# Altium project 20bit_40MS_ADC_DIOT.PrjPcb (part 5 of 5)
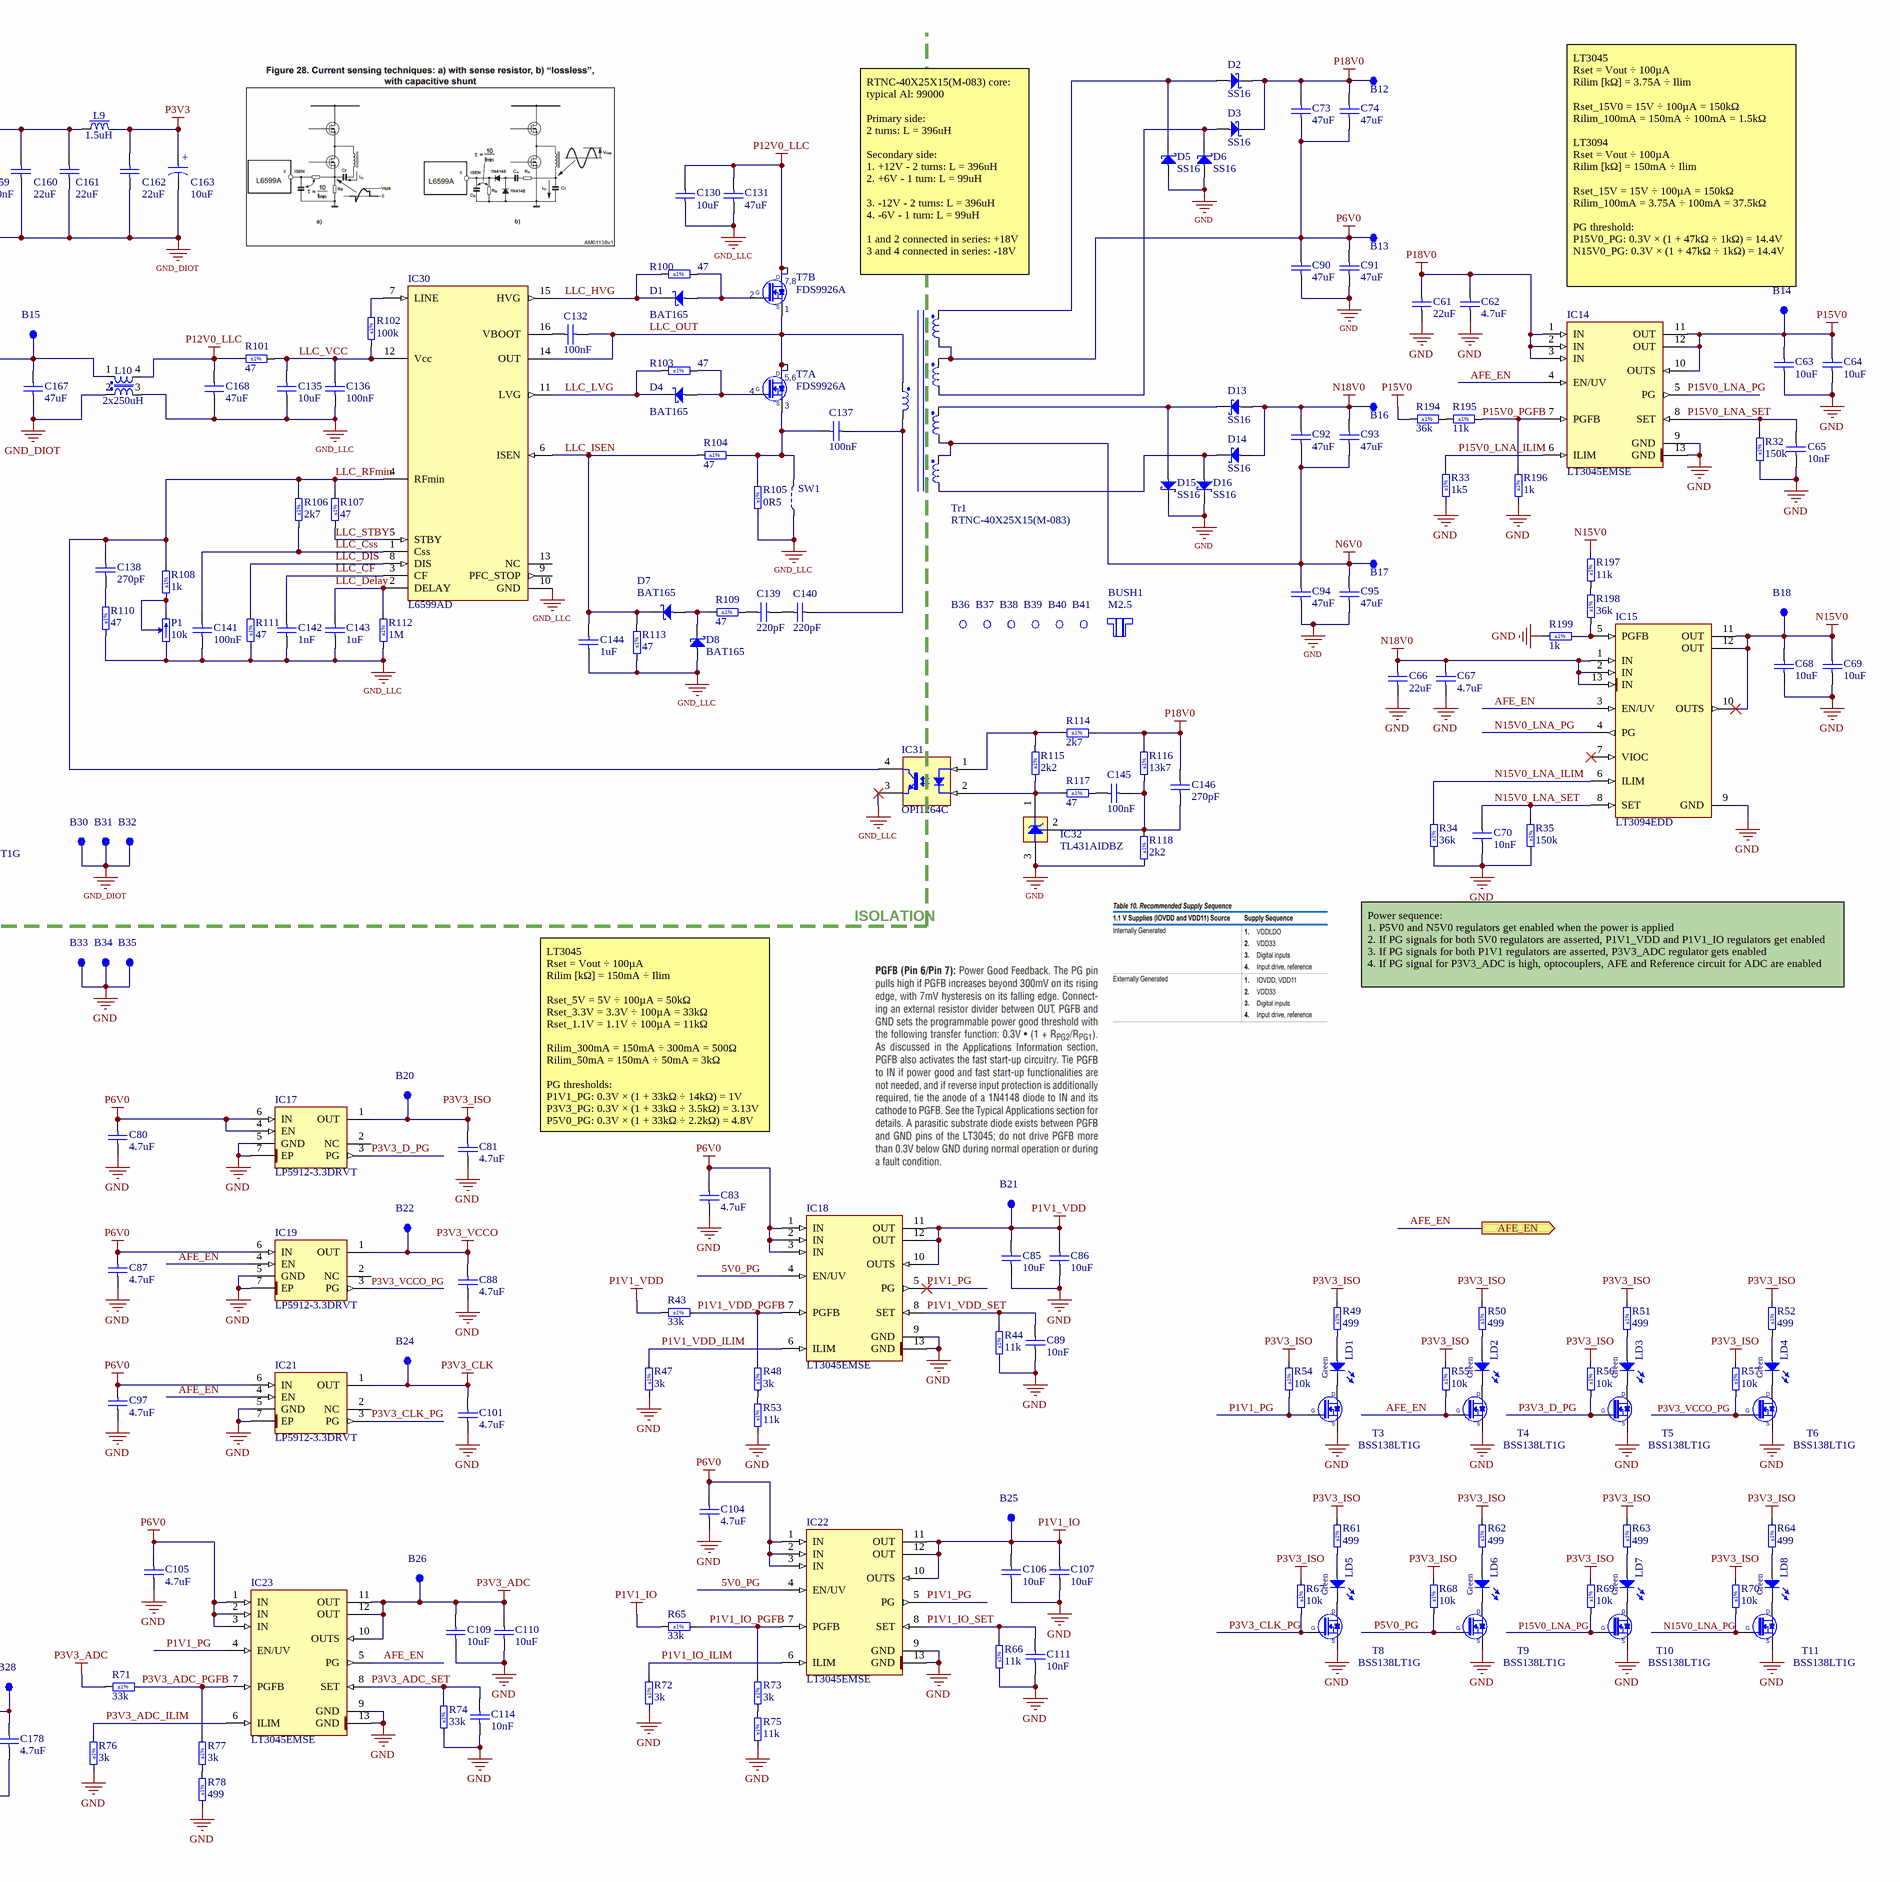
[diagram p11: Isolated_Power_supply.SchDoc, right]

## Nets that join several sheets
GND: ADC_40M20b (C2.2 R31.2 R36.2), CPCIS_Connectors_P1_P6 (66 pins), U_AFE (21 pins), U_LNA (12 pins), U_ADC (18 pins), PLL (44 pins), U_ADC (18 pins), U_AFE (21 pins), U_LNA (12 pins), Data_Interface (13 pins), Optocouplers (82 pins), EEM_Connectors (36 pins), Isolated_Power_supply (155 pins)
N5V0: U_AFE (16 pins), U_AFE (16 pins), Isolated_Power_supply (5 pins)
N15V0: U_LNA (C184B.1 J1B.13), U_LNA (C184A.1 J1A.13), Isolated_Power_supply (7 pins)
P1V1_IO: U_ADC (IC1B.A6), U_ADC (IC1A.A6), Isolated_Power_supply (7 pins)
P1V1_VDD: U_ADC (IC1B.A1 IC1B.A2 IC1B.A3), U_ADC (IC1A.A1 IC1A.A2 IC1A.A3), Isolated_Power_supply (7 pins)
P2V5_VREF: PLL (C155.2 IC35.2), Isolated_Power_supply (5 pins)
P3V0_REF: U_AFE (IC4B.8), U_ADC (C5B.2 IC1B.F4 IC1B.G4), U_ADC (C5A.2 IC1A.F4 IC1A.G4), U_AFE (IC4A.8), Isolated_Power_supply (8 pins)
P3V3: Data_Interface (8 pins), Optocouplers (21 pins), EEM_Connectors (C298.2 IC40.14), Isolated_Power_supply (5 pins)
P3V3_ADC: U_ADC (IC1B.F3 IC1B.G3), U_ADC (IC1A.F3 IC1A.G3), Isolated_Power_supply (7 pins)
P3V3_CLK: PLL (16 pins), Isolated_Power_supply (5 pins)
P3V3_DAC: PLL (6 pins), Isolated_Power_supply (C175.1 C177.2 L11.1 R142.2)
P3V3_DIOT: CPCIS_Connectors_P1_P6 (13 pins), Isolated_Power_supply (C174.1 D22.2 IC38.5)
P3V3_ISO: U_LNA (J1B.1), U_LNA (J1A.1), Data_Interface (C58.2 IC10.6 IC10.16), Optocouplers (17 pins), Isolated_Power_supply (19 pins)
P3V3_MP: EEM_Connectors (5 pins), Isolated_Power_supply (5 pins)
P3V3_VCCO: PLL (8 pins), Isolated_Power_supply (B22.1 C88.2 IC19.1)
P5V0: U_AFE (14 pins), U_AFE (14 pins), Isolated_Power_supply (B19.1 C76.1 C79.2 L7.2)
P12V0_DIOT: CPCIS_Connectors_P1_P6 (7 pins), EEM_Connectors (R257.1 R260.1 R261.1 R262.1), Isolated_Power_supply (C173.2 IC38.1 IC38.3)
P12V0_EEM: EEM_Connectors (8 pins), Isolated_Power_supply (13 pins)
P15V0: U_LNA (C183B.1 J1B.14), U_LNA (C183A.1 J1A.14), Isolated_Power_supply (7 pins)
AD9508_OUT0_N: U_ADC (IC1B.A5 R5B.2), PLL (IC8.3)
AD9508_OUT0_P: U_ADC (IC1B.A4 R5B.1), PLL (IC8.2)
AD9508_OUT1_N: U_ADC (IC1B.B7 R6B.1), PLL (IC8.8)
AD9508_OUT1_P: U_ADC (IC1B.A7 R6B.2), PLL (IC8.7)
AD9508_OUT2_N: PLL (IC8.12), U_ADC (IC1A.A5 R5A.2)
AD9508_OUT2_P: PLL (IC8.11), U_ADC (IC1A.A4 R5A.1)
AD9508_OUT3_N: PLL (IC8.17), U_ADC (IC1A.B7 R6A.1)
AD9508_OUT3_P: PLL (IC8.16), U_ADC (IC1A.A7 R6A.2)
ADC_CSn: U_ADC (B3B.1 IC1B.G1), Data_Interface (IC10.10)
ADC_CSn: U_ADC (B3A.1 IC1A.G1), Data_Interface (IC10.13)
ADC_DA_N: U_ADC (IC1B.D7), Optocouplers (MOD1.26)
ADC_DA_N: U_ADC (IC1A.D7), Optocouplers (MOD1.14)
ADC_DA_P: U_ADC (IC1B.C7), Optocouplers (MOD1.27)
ADC_DA_P: U_ADC (IC1A.C7), Optocouplers (MOD1.15)
ADC_DB_N: U_ADC (IC1B.D6), Optocouplers (MOD1.20)
ADC_DB_N: U_ADC (IC1A.D6), Optocouplers (MOD1.8)
ADC_DB_P: U_ADC (IC1B.C6), Optocouplers (MOD1.21)
ADC_DB_P: U_ADC (IC1A.C6), Optocouplers (MOD1.9)
ADC_SCLK: U_LNA (J1B.4), U_ADC (IC1B.E7), PLL (B6.1 IC7.1 IC8.19 IC35.7), U_ADC (IC1A.E7), U_LNA (J1A.4), Optocouplers (IC28.8)
ADC_SDI: U_LNA (J1B.6), U_ADC (IC1B.F7), PLL (B7.1 IC7.2 IC8.24 IC35.6), U_ADC (IC1A.F7), U_LNA (J1A.6), Optocouplers (IC33.8)
ADCIN_N: U_AFE (R16B.2), U_ADC (R3B.1 R4B.1)
ADCIN_N: U_ADC (R3A.1 R4A.1), U_AFE (R16A.2)
ADCIN_P: U_AFE (R8B.2), U_ADC (R1B.1 R2B.1)
ADCIN_P: U_ADC (R1A.1 R2A.1), U_AFE (R8A.2)
AFE_EN: U_AFE (5 pins), U_LNA (J1B.10), U_AFE (5 pins), U_LNA (J1A.10), Isolated_Power_supply (9 pins)
AFE_IN_N: U_AFE (IC6B.3), U_LNA (J1B.17)
AFE_IN_N: U_AFE (IC6A.3), U_LNA (J1A.17)
AFE_IN_P: U_AFE (IC2B.3), U_LNA (J1B.19)
AFE_IN_P: U_AFE (IC2A.3), U_LNA (J1A.19)
BP_I2C.SCL: CPCIS_Connectors_P1_P6 (D23.3 J6.B2), EEM_Connectors (R187.1)
BP_I2C.SDA: CPCIS_Connectors_P1_P6 (D23.1 J6.C2), EEM_Connectors (R186.1)
BP_IO.LVDS_N0: CPCIS_Connectors_P1_P6 (J6.E3), EEM_Connectors (R161.1)
BP_IO.LVDS_N1: CPCIS_Connectors_P1_P6 (J6.B3), EEM_Connectors (R162.1)
BP_IO.LVDS_N2: CPCIS_Connectors_P1_P6 (J6.C4), EEM_Connectors (R163.1)
BP_IO.LVDS_N3: CPCIS_Connectors_P1_P6 (J6.L4), EEM_Connectors (R164.1)
BP_IO.LVDS_N4: CPCIS_Connectors_P1_P6 (J6.I4), EEM_Connectors (R167.1)
BP_IO.LVDS_N5: CPCIS_Connectors_P1_P6 (J6.K5), EEM_Connectors (R168.1)
BP_IO.LVDS_N6: CPCIS_Connectors_P1_P6 (J6.H5), EEM_Connectors (R169.1)
BP_IO.LVDS_N7: CPCIS_Connectors_P1_P6 (J6.F6), EEM_Connectors (R170.1)
BP_IO.LVDS_N8: CPCIS_Connectors_P1_P6 (J6.C6), EEM_Connectors (R171.1)
BP_IO.LVDS_N9: CPCIS_Connectors_P1_P6 (J6.L6), EEM_Connectors (R172.1)
BP_IO.LVDS_N10: CPCIS_Connectors_P1_P6 (J6.I6), EEM_Connectors (R173.1)
BP_IO.LVDS_N11: CPCIS_Connectors_P1_P6 (J7.E1), EEM_Connectors (R174.1)
BP_IO.LVDS_N12: CPCIS_Connectors_P1_P6 (J7.B1), EEM_Connectors (R175.1)
BP_IO.LVDS_N13: CPCIS_Connectors_P1_P6 (J7.K1), EEM_Connectors (R176.1)
BP_IO.LVDS_N14: CPCIS_Connectors_P1_P6 (J7.H1), EEM_Connectors (R177.1)
BP_IO.LVDS_N15: CPCIS_Connectors_P1_P6 (J6.F2), EEM_Connectors (R144.2)
BP_IO.LVDS_P0: CPCIS_Connectors_P1_P6 (J6.D3), EEM_Connectors (R145.1)
BP_IO.LVDS_P1: CPCIS_Connectors_P1_P6 (J6.A3), EEM_Connectors (R146.1)
BP_IO.LVDS_P2: CPCIS_Connectors_P1_P6 (J6.B4), EEM_Connectors (R147.1)
BP_IO.LVDS_P3: CPCIS_Connectors_P1_P6 (J6.K4), EEM_Connectors (R148.1)
BP_IO.LVDS_P4: CPCIS_Connectors_P1_P6 (J6.H4), EEM_Connectors (R149.1)
BP_IO.LVDS_P5: CPCIS_Connectors_P1_P6 (J6.J5), EEM_Connectors (R150.1)
BP_IO.LVDS_P6: CPCIS_Connectors_P1_P6 (J6.G5), EEM_Connectors (R151.1)
BP_IO.LVDS_P7: CPCIS_Connectors_P1_P6 (J6.E6), EEM_Connectors (R152.1)
BP_IO.LVDS_P8: CPCIS_Connectors_P1_P6 (J6.B6), EEM_Connectors (R188.1)
BP_IO.LVDS_P9: CPCIS_Connectors_P1_P6 (J6.K6), EEM_Connectors (R189.1)
BP_IO.LVDS_P10: CPCIS_Connectors_P1_P6 (J6.H6), EEM_Connectors (R190.1)
BP_IO.LVDS_P11: CPCIS_Connectors_P1_P6 (J7.D1), EEM_Connectors (R156.1)
BP_IO.LVDS_P12: CPCIS_Connectors_P1_P6 (J7.A1), EEM_Connectors (R157.1)
BP_IO.LVDS_P13: CPCIS_Connectors_P1_P6 (J7.J1), EEM_Connectors (R158.1)
BP_IO.LVDS_P14: CPCIS_Connectors_P1_P6 (J7.G1), EEM_Connectors (R159.1)
BP_IO.LVDS_P15: CPCIS_Connectors_P1_P6 (J6.E2), EEM_Connectors (R143.2)
CSn_0: Data_Interface (IC10.1), Optocouplers (IC34.8)
CSn_1: Data_Interface (IC10.2), Optocouplers (IC27.8)
CSn_2: Data_Interface (IC10.3), Optocouplers (IC29.8)
CSn_AD4350: PLL (B9.1 IC7.3), Data_Interface (IC10.14)
CSn_AD9508: PLL (B10.1 IC8.1), Data_Interface (IC10.12)
CSn_DAC: PLL (B11.1 IC35.5), Data_Interface (IC10.15)
CSn_LNA_CH_A: U_LNA (B4B.1 J1B.8), Data_Interface (IC10.11)
CSn_LNA_CH_B: U_LNA (B4A.1 J1A.8), Data_Interface (IC10.9)
DIOT_ADC_A_DA_N: Optocouplers (MOD2.5), EEM_Connectors (J8.6 R162.2)
DIOT_ADC_A_DA_P: Optocouplers (MOD2.6), EEM_Connectors (J8.5 R146.2)
DIOT_ADC_A_DB_N: Optocouplers (MOD2.11), EEM_Connectors (J8.9 R163.2)
DIOT_ADC_A_DB_P: Optocouplers (MOD2.12), EEM_Connectors (J8.8 R147.2)
DIOT_ADC_B_DA_N: Optocouplers (MOD2.17), EEM_Connectors (J8.12 R164.2)
DIOT_ADC_B_DA_P: Optocouplers (MOD2.18), EEM_Connectors (J8.11 R148.2)
DIOT_ADC_B_DB_N: Optocouplers (MOD2.23), EEM_Connectors (J8.15 R167.2)
DIOT_ADC_B_DB_P: Optocouplers (MOD2.24), EEM_Connectors (J8.14 R149.2)
DIOT_CLK_DIOT_N: Optocouplers (MOD2.29), EEM_Connectors (J8.3 R161.2)
DIOT_CLK_DIOT_P: Optocouplers (MOD2.30), EEM_Connectors (J8.2 R145.2)
DIOT_CLK_N: PLL (C29.1), Optocouplers (MOD1.3)
DIOT_CLK_P: PLL (C28.1), Optocouplers (MOD1.2)
DIOT_CSn_0: Data_Interface (IC12.7), Optocouplers (R98.2)
DIOT_CSn_1: Data_Interface (IC12.6), Optocouplers (R82.2)
DIOT_CSn_2: Data_Interface (IC13.7), Optocouplers (R90.2)
DIOT_SPI_CLK: Data_Interface (IC11.7), Optocouplers (R89.2)
DIOT_SPI_MISO: Data_Interface (IC9.2), Optocouplers (IC26.8)
DIOT_SPI_MOSI: Data_Interface (IC11.6), Optocouplers (R97.2)
EEM0_I2C.SCL: EEM_Connectors (6 pins), Isolated_Power_supply (IC37.2)
EEM0_I2C.SDA: EEM_Connectors (6 pins), Isolated_Power_supply (IC37.1)
EEM_IO.LVDS_N8: Data_Interface (IC9.7), EEM_Connectors (J9.3 R171.2)
EEM_IO.LVDS_N9: Data_Interface (IC11.4 R26.1), EEM_Connectors (J9.6 R172.2)
EEM_IO.LVDS_N10: Data_Interface (IC11.1 R25.2), EEM_Connectors (J9.9 R173.2)
EEM_IO.LVDS_N11: Data_Interface (IC12.4 R28.1), EEM_Connectors (J9.12 R174.2)
EEM_IO.LVDS_N12: Data_Interface (IC12.1 R27.2), EEM_Connectors (J9.15 R175.2)
EEM_IO.LVDS_N13: Data_Interface (IC13.1 R29.2), EEM_Connectors (J9.18 R176.2)
EEM_IO.LVDS_P8: Data_Interface (IC9.8), EEM_Connectors (J9.2 R188.2)
EEM_IO.LVDS_P9: Data_Interface (IC11.3 R26.2), EEM_Connectors (J9.5 R189.2)
EEM_IO.LVDS_P10: Data_Interface (IC11.2 R25.1), EEM_Connectors (J9.8 R190.2)
EEM_IO.LVDS_P11: Data_Interface (IC12.3 R28.2), EEM_Connectors (J9.11 R156.2)
EEM_IO.LVDS_P12: Data_Interface (IC12.2 R27.1), EEM_Connectors (J9.14 R157.2)
EEM_IO.LVDS_P13: Data_Interface (IC13.2 R29.1), EEM_Connectors (J9.17 R158.2)
LNA_MISO: U_LNA (J1B.2), PLL (B8.1 IC8.4), U_LNA (J1A.2), Optocouplers (R81.2)
PGOOD: CPCIS_Connectors_P1_P6 (R155.1 T2.1), Isolated_Power_supply (IC36.7 R140#2.1 T18.1)
PSU_EN: CPCIS_Connectors_P1_P6 (R182.2), Isolated_Power_supply (IC36.8 R134#2.1 R135#2.2 R193.2)
SERVMOD_3V3: CPCIS_Connectors_P1_P6 (R138.1 R153.2), EEM_Connectors (IC40.5 IC40.6 IC40.12 IC40.13)

## Assembly variants
DIOT: not fitted BUSH1 C82 C155 C157 C178 C219 C220 C307 IC35 IC39 IC44 IC45 IC46 R125 R142
EEM: not fitted BUSH1 C1 C155 C157 C179 C180 C181 C182 C219 C220 D23 D24 D25 D26 IC35 IC41 IC42 IC44 IC46 J6 J7 R37 R125 R130 R131 R133 R136 R138 R143 R144 R145 R146 R147 R148 R149 R150 R151 R152 R153 R154 R155 R156 R157 R158 R159 R160 R161 R162 R163 R164 R165 R166 R167 R168 R169 R170 R171 R172 R173 R174 R175 R176 R177 R178 R179 R180 R181 R182 R183 R184 R185 R186 R187 R188 R189 R190 R257 R260 R261 R262 T1 T2 T19 T20